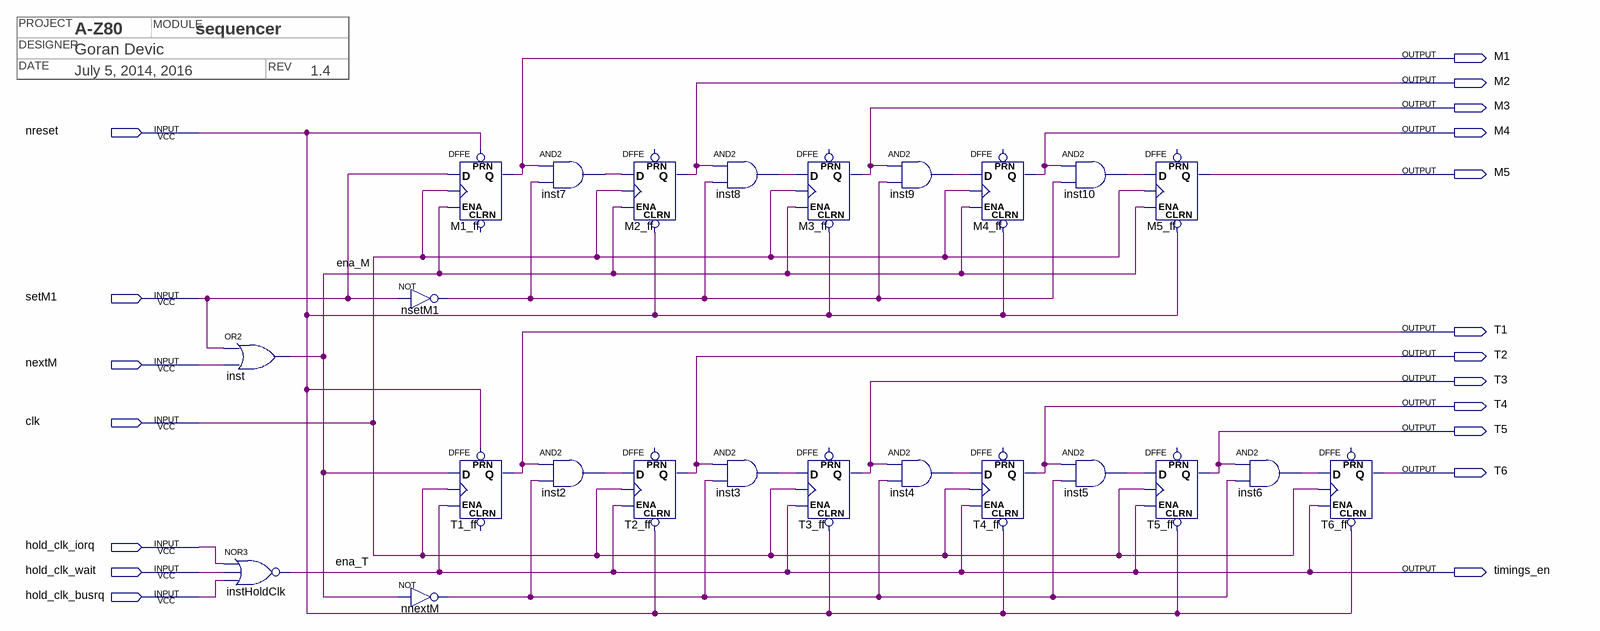
[diagram p0: schematic sheet]
// Quartus schematic sequencer.bdf as structural Verilog: 24 symbols, 19 pins
// Title block: DATE: July 5, 2014, 2016; DESIGNER: Goran Devic; MODULE: sequencer; PROJECT: A-Z80; REV: 1.4
module sequencer (
  input  nreset,
  input  setM1,
  input  nextM,
  input  clk,
  input  hold_clk_iorq,
  input  hold_clk_wait,
  input  hold_clk_busrq,
  output M1,
  output M2,
  output M3,
  output M4,
  output M5,
  output T1,
  output T2,
  output T3,
  output T4,
  output T5,
  output T6,
  output timings_en
);

  wire ena_M, inst2_out, inst3_out, inst4_out, inst5_out, inst6_out, inst7_out, inst8_out, inst9_out,
       inst10_out, nnextM_out, nsetM1_out;

  or inst (ena_M, setM1, nextM);
  nor instHoldClk (timings_en, hold_clk_iorq, hold_clk_wait, hold_clk_busrq);
  DFFE M1_ff (.PRN(nreset), .D(setM1), .CLK(clk), .ENA(ena_M), .Q(M1));  // open: CLRN
  not nsetM1 (nsetM1_out, setM1);
  DFFE T1_ff (.PRN(nreset), .D(ena_M), .CLK(clk), .ENA(timings_en), .Q(T1));  // open: CLRN
  not nnextM (nnextM_out, ena_M);
  and inst7 (inst7_out, M1, nsetM1_out);
  and inst2 (inst2_out, T1, nnextM_out);
  DFFE M2_ff (.CLRN(nreset), .D(inst7_out), .CLK(clk), .ENA(ena_M), .Q(M2));  // open: PRN
  DFFE T2_ff (.CLRN(nreset), .D(inst2_out), .CLK(clk), .ENA(timings_en), .Q(T2));  // open: PRN
  and inst8 (inst8_out, M2, nsetM1_out);
  and inst3 (inst3_out, T2, nnextM_out);
  DFFE M3_ff (.CLRN(nreset), .D(inst8_out), .CLK(clk), .ENA(ena_M), .Q(M3));  // open: PRN
  DFFE T3_ff (.CLRN(nreset), .D(inst3_out), .CLK(clk), .ENA(timings_en), .Q(T3));  // open: PRN
  and inst9 (inst9_out, M3, nsetM1_out);
  and inst4 (inst4_out, T3, nnextM_out);
  DFFE M4_ff (.CLRN(nreset), .D(inst9_out), .CLK(clk), .ENA(ena_M), .Q(M4));  // open: PRN
  DFFE T4_ff (.CLRN(nreset), .D(inst4_out), .CLK(clk), .ENA(timings_en), .Q(T4));  // open: PRN
  and inst10 (inst10_out, M4, nsetM1_out);
  and inst5 (inst5_out, T4, nnextM_out);
  DFFE M5_ff (.CLRN(nreset), .D(inst10_out), .CLK(clk), .ENA(ena_M), .Q(M5));  // open: PRN
  DFFE T5_ff (.CLRN(nreset), .D(inst5_out), .CLK(clk), .ENA(timings_en), .Q(T5));  // open: PRN
  and inst6 (inst6_out, T5, nnextM_out);
  DFFE T6_ff (.CLRN(nreset), .D(inst6_out), .CLK(clk), .ENA(timings_en), .Q(T6));  // open: PRN

  // Other names for the same wires on the sheet: ena_T = timings_en
endmodule
